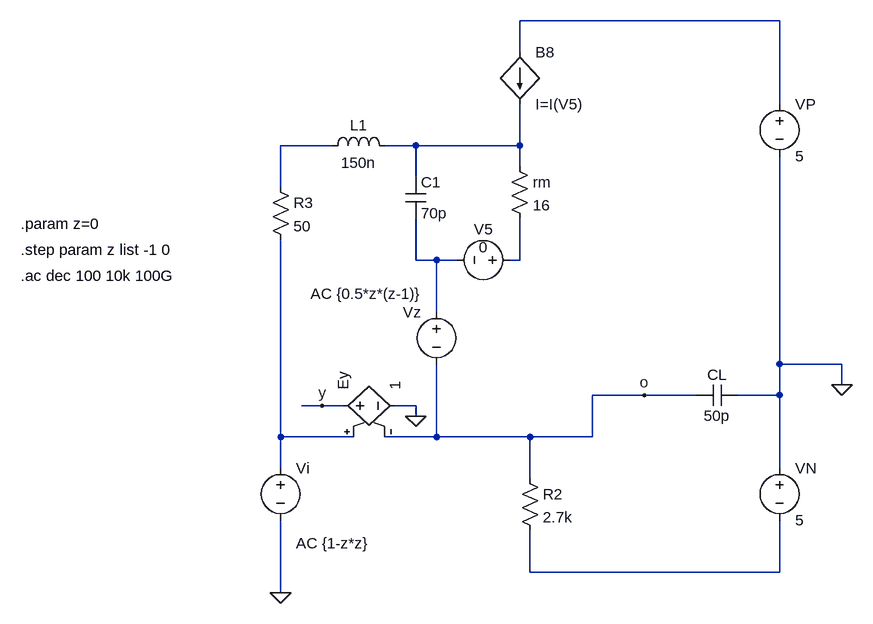
[diagram p0: schematic manual3a.asc]
manual3a.asc, the LTspice schematic file:
Version 4
SHEET 1 880 804
WIRE 672 -96 272 -96
WIRE 272 -48 272 -96
WIRE 672 32 672 -96
WIRE -16 96 -96 96
WIRE 112 96 64 96
WIRE 272 96 272 32
WIRE 272 96 112 96
WIRE 272 128 272 96
WIRE 112 144 112 96
WIRE -96 160 -96 96
WIRE 112 272 112 208
WIRE 144 272 112 272
WIRE 176 272 144 272
WIRE 272 272 272 208
WIRE 272 272 256 272
WIRE 144 352 144 272
WIRE 672 432 672 112
WIRE 768 432 672 432
WIRE 768 464 768 432
WIRE 464 480 384 480
WIRE 544 480 464 480
WIRE 672 480 672 432
WIRE 672 480 608 480
WIRE -32 496 -64 496
WIRE 0 496 -32 496
WIRE 112 496 80 496
WIRE 112 512 112 496
WIRE -96 544 -96 240
WIRE 16 544 -96 544
WIRE 144 544 144 432
WIRE 144 544 64 544
WIRE 288 544 144 544
WIRE 384 544 384 480
WIRE 384 544 288 544
WIRE -96 592 -96 544
WIRE 672 592 672 480
WIRE 288 608 288 544
WIRE 288 752 288 688
WIRE 672 752 672 672
WIRE 672 752 288 752
WIRE -96 784 -96 672
FLAG -96 784 0
FLAG 112 512 0
FLAG -32 496 y
FLAG 464 480 o
FLAG 768 464 0
SYMBOL res -112 144 R0
SYMATTR InstName R3
SYMATTR Value 50
SYMBOL ind -32 112 R270
WINDOW 0 32 56 VTop 2
WINDOW 3 5 56 VBottom 2
SYMATTR InstName L1
SYMATTR Value 150n
SYMBOL cap 96 144 R0
SYMATTR InstName C1
SYMATTR Value 70p
SYMBOL res 256 112 R0
SYMATTR InstName rm
SYMATTR Value 16
SYMBOL voltage 272 272 R90
WINDOW 0 -32 56 VBottom 2
WINDOW 3 -4 56 VBottom 2
WINDOW 123 0 0 Left 2
WINDOW 39 0 0 Left 2
SYMATTR InstName V5
SYMATTR Value 0
SYMBOL bi 272 -48 R0
SYMATTR InstName B8
SYMATTR Value I=I(V5)
SYMBOL voltage 672 16 R0
SYMATTR InstName VP
SYMATTR Value 5
SYMBOL voltage 672 576 R0
SYMATTR InstName VN
SYMATTR Value 5
SYMBOL voltage -96 576 R0
WINDOW 123 24 132 Left 2
WINDOW 39 0 0 Left 2
SYMATTR Value2 AC {1-z*z}
SYMATTR InstName Vi
SYMATTR Value ""
SYMBOL res 272 592 R0
SYMATTR InstName R2
SYMATTR Value 2.7k
SYMBOL cap 608 464 R90
WINDOW 0 0 32 VBottom 2
WINDOW 3 32 32 VTop 2
SYMATTR InstName CL
SYMATTR Value 50p
SYMBOL e -16 496 R270
SYMATTR InstName Ey
SYMATTR Value 1
SYMBOL voltage 144 336 M0
WINDOW 123 24 -12 Left 2
WINDOW 39 0 0 Left 2
SYMATTR Value2 AC {0.5*z*(z-1)}
SYMATTR InstName Vz
SYMATTR Value ""
TEXT -496 296 Left 2 !.ac dec 100 10k 100G
TEXT -496 216 Left 2 !.param z=0
TEXT -496 256 Left 2 !.step param z list -1 0

The netlist it stands for:
* manual3a.asc
R3 N002 N006 50
L1 N002 N003 150n
C1 N003 N004 70p
rm N003 N005 16
V5 N005 N004 0
B8 N001 N003 I=I(V5)
VP N001 0 5
VN 0 N007 5
Vi N006 0 AC {1-z*z}
R2 o N007 2.7k
CL 0 o 50p
Ey y 0 N006 o 1
Vz N004 o AC {0.5*z*(z-1)}
.ac dec 100 10k 100G
.param z=0
.step param z list -1 0
.backanno
.end